# Altium schematic sheet Sheet2.SchDoc
size A4
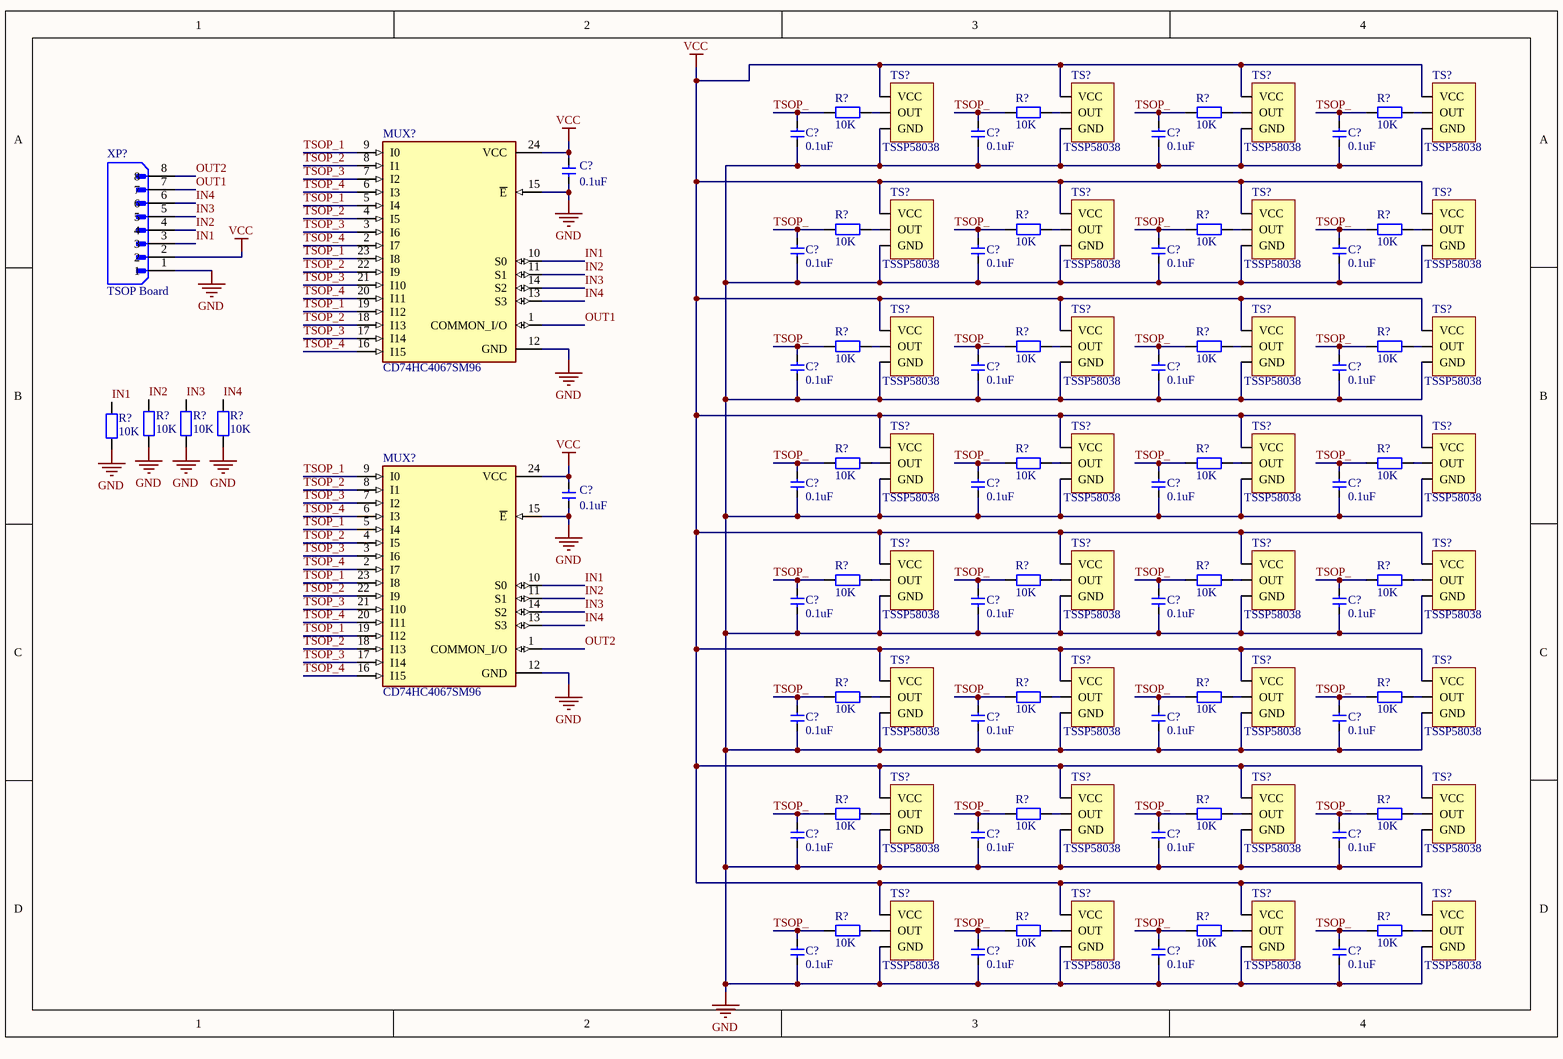
[diagram p0: Sheet2.SchDoc]

## Parts
(Parts that share a designator on the sheet are numbered #1, #2 ... from top to bottom, then left to right.)
C?#1  0.1uF  [CAP0805]
C?#2  0.1uF  [CAP0805]
C?#3  0.1uF  [CAP0805]
C?#4  0.1uF  [CAP0805]
C?#5  0.1uF  [CAP0805]
C?#6  0.1uF  [CAP0805]
C?#7  0.1uF  [CAP0805]
C?#8  0.1uF  [CAP0805]
C?#9  0.1uF  [CAP0805]
C?#10  0.1uF  [CAP0805]
C?#11  0.1uF  [CAP0805]
C?#12  0.1uF  [CAP0805]
C?#13  0.1uF  [CAP0805]
C?#14  0.1uF  [CAP0805]
C?#15  0.1uF  [CAP0805]
C?#16  0.1uF  [CAP0805]
C?#17  0.1uF  [CAP0805]
C?#18  0.1uF  [CAP0805]
C?#19  0.1uF  [CAP0805]
C?#20  0.1uF  [CAP0805]
C?#21  0.1uF  [CAP0805]
C?#22  0.1uF  [CAP0805]
C?#23  0.1uF  [CAP0805]
C?#24  0.1uF  [CAP0805]
C?#25  0.1uF  [CAP0805]
C?#26  0.1uF  [CAP0805]
C?#27  0.1uF  [CAP0805]
C?#28  0.1uF  [CAP0805]
C?#29  0.1uF  [CAP0805]
C?#30  0.1uF  [CAP0805]
C?#31  0.1uF  [CAP0805]
C?#32  0.1uF  [CAP0805]
C?#33  0.1uF  [CAP0805]
C?#34  0.1uF  [CAP0805]
MUX?#1  CD74HC4067SM96  [SSOP-24]
MUX?#2  CD74HC4067SM96  [SSOP-24]
R?#1  10K  [RES0805]
R?#2  10K  [RES0805]
R?#3  10K  [RES0805]
R?#4  10K  [RES0805]
R?#5  10K  [RES0805]
R?#6  10K  [RES0805]
R?#7  10K  [RES0805]
R?#8  10K  [RES0805]
R?#9  10K  [RES0805]
R?#10  10K  [RES0805]
R?#11  10K  [RES0805]
R?#12  10K  [RES0805]
R?#13  10K  [RES0805]
R?#14  10K  [RES0805]
R?#15  10K  [RES0805]
R?#16  10K  [RES0805]
R?#17  10K  [RES0805]
R?#18  10K  [RES0805]
R?#19  10K  [RES0805]
R?#20  10K  [RES0805]
R?#21  10K  [RES0805]
R?#22  10K  [RES0805]
R?#23  10K  [RES0805]
R?#24  10K  [RES0805]
R?#25  10K  [RES0805]
R?#26  10K  [RES0805]
R?#27  10K  [RES0805]
R?#28  10K  [RES0805]
R?#29  10K  [RES0805]
R?#30  10K  [RES0805]
R?#31  10K  [RES0805]
R?#32  10K  [RES0805]
R?#33  10K  [RES0805]
R?#34  10K  [RES0805]
R?#35  10K  [RES0805]
R?#36  10K  [RES0805]
TS?#1  TSSP58038  [TSSP58038]
TS?#2  TSSP58038  [TSSP58038]
TS?#3  TSSP58038  [TSSP58038]
TS?#4  TSSP58038  [TSSP58038]
TS?#5  TSSP58038  [TSSP58038]
TS?#6  TSSP58038  [TSSP58038]
TS?#7  TSSP58038  [TSSP58038]
TS?#8  TSSP58038  [TSSP58038]
TS?#9  TSSP58038  [TSSP58038]
TS?#10  TSSP58038  [TSSP58038]
TS?#11  TSSP58038  [TSSP58038]
TS?#12  TSSP58038  [TSSP58038]
TS?#13  TSSP58038  [TSSP58038]
TS?#14  TSSP58038  [TSSP58038]
TS?#15  TSSP58038  [TSSP58038]
TS?#16  TSSP58038  [TSSP58038]
TS?#17  TSSP58038  [TSSP58038]
TS?#18  TSSP58038  [TSSP58038]
TS?#19  TSSP58038  [TSSP58038]
TS?#20  TSSP58038  [TSSP58038]
TS?#21  TSSP58038  [TSSP58038]
TS?#22  TSSP58038  [TSSP58038]
TS?#23  TSSP58038  [TSSP58038]
TS?#24  TSSP58038  [TSSP58038]
TS?#25  TSSP58038  [TSSP58038]
TS?#26  TSSP58038  [TSSP58038]
TS?#27  TSSP58038  [TSSP58038]
TS?#28  TSSP58038  [TSSP58038]
TS?#29  TSSP58038  [TSSP58038]
TS?#30  TSSP58038  [TSSP58038]
TS?#31  TSSP58038  [TSSP58038]
TS?#32  TSSP58038  [TSSP58038]
XP?  TSOP Board  [JST_XH-8]

## Nets
GND: C?#1.1 C?#2.1 C?#3.1 C?#4.1 C?#5.1 C?#6.1 C?#7.1 C?#8.1 C?#9.1 C?#10.1 C?#11.1 C?#12.1 C?#13.1 C?#14.1 C?#15.1 C?#16.1 C?#17.1 C?#18.1 C?#19.1 C?#20.1 C?#21.1 C?#22.1 C?#23.1 C?#24.1 C?#25.1 C?#26.1 C?#27.1 C?#28.1 C?#29.1 C?#30.1 C?#31.1 C?#32.1 C?#33.1 C?#34.1 MUX?#1.12(GND) MUX?#1.15(~{E}) MUX?#2.12(GND) MUX?#2.15(~{E}) R?#13.1 R?#14.1 R?#15.1 R?#16.1 TS?#1.2(GND) TS?#2.2(GND) TS?#3.2(GND) TS?#4.2(GND) TS?#5.2(GND) TS?#6.2(GND) TS?#7.2(GND) TS?#8.2(GND) TS?#9.2(GND) TS?#10.2(GND) TS?#11.2(GND) TS?#12.2(GND) TS?#13.2(GND) TS?#14.2(GND) TS?#15.2(GND) TS?#16.2(GND) TS?#17.2(GND) TS?#18.2(GND) TS?#19.2(GND) TS?#20.2(GND) TS?#21.2(GND) TS?#22.2(GND) TS?#23.2(GND) TS?#24.2(GND) TS?#25.2(GND) TS?#26.2(GND) TS?#27.2(GND) TS?#28.2(GND) TS?#29.2(GND) TS?#30.2(GND) TS?#31.2(GND) TS?#32.2(GND) XP?.1
VCC: C?#5.2 C?#18.2 MUX?#1.24(VCC) MUX?#2.24(VCC) TS?#1.1(VCC) TS?#2.1(VCC) TS?#3.1(VCC) TS?#4.1(VCC) TS?#5.1(VCC) TS?#6.1(VCC) TS?#7.1(VCC) TS?#8.1(VCC) TS?#9.1(VCC) TS?#10.1(VCC) TS?#11.1(VCC) TS?#12.1(VCC) TS?#13.1(VCC) TS?#14.1(VCC) TS?#15.1(VCC) TS?#16.1(VCC) TS?#17.1(VCC) TS?#18.1(VCC) TS?#19.1(VCC) TS?#20.1(VCC) TS?#21.1(VCC) TS?#22.1(VCC) TS?#23.1(VCC) TS?#24.1(VCC) TS?#25.1(VCC) TS?#26.1(VCC) TS?#27.1(VCC) TS?#28.1(VCC) TS?#29.1(VCC) TS?#30.1(VCC) TS?#31.1(VCC) TS?#32.1(VCC) XP?.2
IN1: MUX?#1.10(S0) MUX?#2.10(S0) R?#13.2 XP?.3
IN2: MUX?#1.11(S1) MUX?#2.11(S1) R?#14.2 XP?.4
IN3: MUX?#1.14(S2) MUX?#2.14(S2) R?#15.2 XP?.5
IN4: MUX?#1.13(S3) MUX?#2.13(S3) R?#16.2 XP?.6
OUT1: MUX?#1.1(COMMON_I/O) XP?.7
OUT2: MUX?#2.1(COMMON_I/O) XP?.8
TSOP_: C?#1.2 C?#2.2 C?#3.2 C?#4.2 C?#6.2 C?#7.2 C?#8.2 C?#9.2 C?#10.2 C?#11.2 C?#12.2 C?#13.2 C?#14.2 C?#15.2 C?#16.2 C?#17.2 C?#19.2 C?#20.2 C?#21.2 C?#22.2 C?#23.2 C?#24.2 C?#25.2 C?#26.2 C?#27.2 C?#28.2 C?#29.2 C?#30.2 C?#31.2 C?#32.2 C?#33.2 C?#34.2 R?#1.1 R?#2.1 R?#3.1 R?#4.1 R?#5.1 R?#6.1 R?#7.1 R?#8.1 R?#9.1 R?#10.1 R?#11.1 R?#12.1 R?#17.1 R?#18.1 R?#19.1 R?#20.1 R?#21.1 R?#22.1 R?#23.1 R?#24.1 R?#25.1 R?#26.1 R?#27.1 R?#28.1 R?#29.1 R?#30.1 R?#31.1 R?#32.1 R?#33.1 R?#34.1 R?#35.1 R?#36.1
TSOP_1: MUX?#1.5(I4) MUX?#1.9(I0) MUX?#1.19(I12) MUX?#1.23(I8) MUX?#2.5(I4) MUX?#2.9(I0) MUX?#2.19(I12) MUX?#2.23(I8)
TSOP_2: MUX?#1.4(I5) MUX?#1.8(I1) MUX?#1.18(I13) MUX?#1.22(I9) MUX?#2.4(I5) MUX?#2.8(I1) MUX?#2.18(I13) MUX?#2.22(I9)
TSOP_3: MUX?#1.3(I6) MUX?#1.7(I2) MUX?#1.17(I14) MUX?#1.21(I10) MUX?#2.3(I6) MUX?#2.7(I2) MUX?#2.17(I14) MUX?#2.21(I10)
TSOP_4: MUX?#1.2(I7) MUX?#1.6(I3) MUX?#1.16(I15) MUX?#1.20(I11) MUX?#2.2(I7) MUX?#2.6(I3) MUX?#2.16(I15) MUX?#2.20(I11)
NetR?#1_2: R?#1.2 TS?#1.3(OUT)
NetR?#2_2: R?#2.2 TS?#2.3(OUT)
NetR?#3_2: R?#3.2 TS?#3.3(OUT)
NetR?#4_2: R?#4.2 TS?#4.3(OUT)
NetR?#5_2: R?#5.2 TS?#5.3(OUT)
NetR?#6_2: R?#6.2 TS?#6.3(OUT)
NetR?#7_2: R?#7.2 TS?#7.3(OUT)
NetR?#8_2: R?#8.2 TS?#8.3(OUT)
NetR?#9_2: R?#9.2 TS?#9.3(OUT)
NetR?#10_2: R?#10.2 TS?#10.3(OUT)
NetR?#11_2: R?#11.2 TS?#11.3(OUT)
NetR?#12_2: R?#12.2 TS?#12.3(OUT)
NetR?#17_2: R?#17.2 TS?#13.3(OUT)
NetR?#18_2: R?#18.2 TS?#14.3(OUT)
NetR?#19_2: R?#19.2 TS?#15.3(OUT)
NetR?#20_2: R?#20.2 TS?#16.3(OUT)
NetR?#21_2: R?#21.2 TS?#17.3(OUT)
NetR?#22_2: R?#22.2 TS?#18.3(OUT)
NetR?#23_2: R?#23.2 TS?#19.3(OUT)
NetR?#24_2: R?#24.2 TS?#20.3(OUT)
NetR?#25_2: R?#25.2 TS?#21.3(OUT)
NetR?#26_2: R?#26.2 TS?#22.3(OUT)
NetR?#27_2: R?#27.2 TS?#23.3(OUT)
NetR?#28_2: R?#28.2 TS?#24.3(OUT)
NetR?#29_2: R?#29.2 TS?#25.3(OUT)
NetR?#30_2: R?#30.2 TS?#26.3(OUT)
NetR?#31_2: R?#31.2 TS?#27.3(OUT)
NetR?#32_2: R?#32.2 TS?#28.3(OUT)
NetR?#33_2: R?#33.2 TS?#29.3(OUT)
NetR?#34_2: R?#34.2 TS?#30.3(OUT)
NetR?#35_2: R?#35.2 TS?#31.3(OUT)
NetR?#36_2: R?#36.2 TS?#32.3(OUT)

## Library data of the parts
C?#1-C?#34 = CAP Ceramic: Ceramic SMD Cap
MUX?#1 MUX?#2 = CD74HC4067SM96: 16-channel multiplexer; ComponentLink1Description: Chipdip; ComponentLink1URL: https://www.chipdip.ru/product0/8016170563
R?#1-R?#36 = RES: RES smd
TS?#1-TS?#32 = TSSP58038: TSOP TSSP58038
XP? = JST-XH-8: JST_B8B-XH-A(LF)(SN)